# Altium project recall_ble_mod_v0_1.PrjPcb
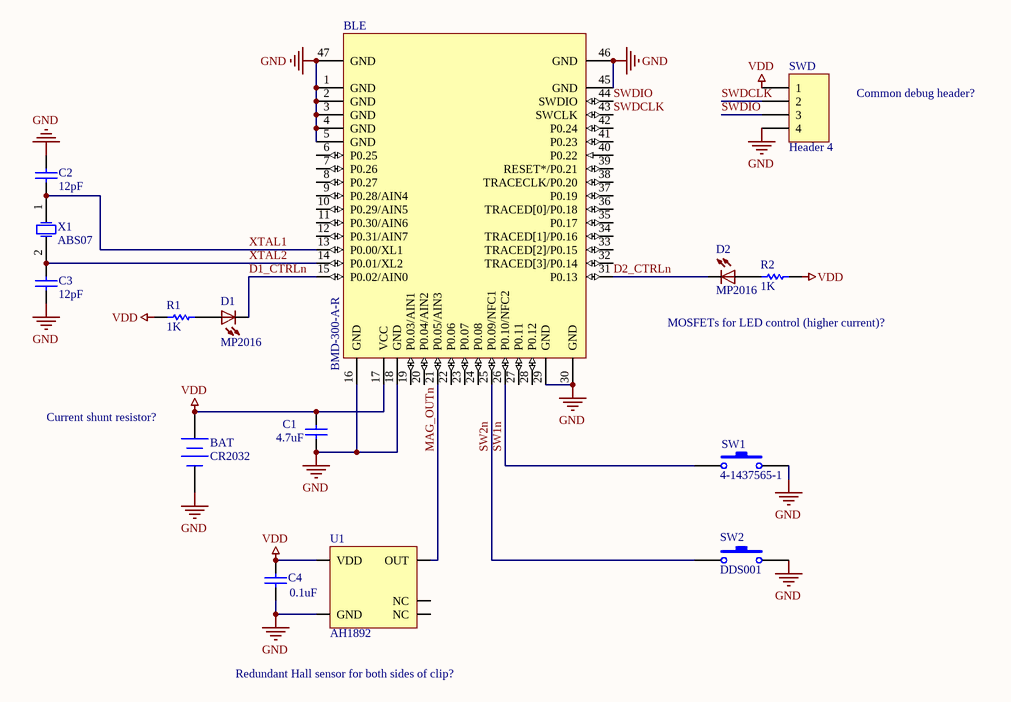
[diagram p0: recall_ble_mod_v0_1.SchDoc]
1 sheet, 15 parts. Net scope: global (net labels, ports and power ports of the same name join across sheets).
Board file: recall_ble_mod_v0_1.PcbDoc

## Sheet recall_ble_mod_v0_1.SchDoc
size A

### Parts
BAT  CR2032  [BAT-HLD-001-THM]
BLE  Manufacturer P/N: BMD-300-A-R  [BMD-300]  (hidden comment: BMD-300)
C1  value 4.7uF  [CAP_0603R]  (hidden comment: CAP)
C2  value 12pF  [CAP_0402R]  (hidden comment: CAP)
C3  value 12pF  [CAP_0402R]  (hidden comment: CAP)
C4  value 0.1uF  [CAP_0402R]  (hidden comment: CAP)
D1  MP2016  [MP2016_centered]
D2  MP2016  [MP2016_centered]
R1  value 1K  [RES_0402]  (hidden comment: RES)
R2  value 1K  [RES_0402]  (hidden comment: RES)
SW1  4-1437565-1  [4-1437565-1]
SW2  DDS001  [DDS001]
SWD  Header 4  [HDR1X4_SWD]
U1  AH1892  [sot-553]
X1  ABS07  [ABS07]

### Nets
GND: BAT.2(-) BLE.1(GND) BLE.2(GND) BLE.3(GND) BLE.4(GND) BLE.5(GND) BLE.16(GND) BLE.18(GND) BLE.29(GND) BLE.30(GND) BLE.45(GND) BLE.46(GND) BLE.47(GND) C1.1 C2.1 C3.1 C4.1 SW1.2 SW2.2 SWD.4 U1.4(GND)
VDD: BAT.1(+) BLE.17(VCC) C1.2 C4.2 R1.1 R2.1 SWD.1 U1.1(VDD)
D1_CTRLn: BLE.15(P0.02/AIN0) D1.C
D2_CTRLn: BLE.31(P0.13) D2.C
MAG_OUTn: BLE.21(P0.05/AIN3) U1.5(OUT)
SW1n: BLE.26(P0.10/NFC2) SW1.1
SW2n: BLE.25(P0.09/NFC1) SW2.1
SWDCLK: BLE.43(SWCLK) SWD.2
SWDIO: BLE.44(SWDIO) SWD.3
XTAL1: BLE.13(P0.00/XL1) C2.2 X1.1(OSC1)
XTAL2: BLE.14(P0.01/XL2) C3.2 X1.2(OSC2)
NetD1_A: D1.A R1.2
NetD2_A: D2.A R2.2

Not connected (* = marked no-connect by the designer): BLE 6(P0.25) 7(P0.26) 8(P0.27) 9(P0.28/AIN4) 10(P0.29/AIN5) 11(P0.30/AIN6) 12(P0.31/AIN7) 19(P0.03/AIN1) 20(P0.04/AIN2) 22(P0.06) 23(P0.07) 24(P0.08) 27(P0.11) 28(P0.12) 32(TRACED[3]/P0.14) 33(TRACED[2]/P0.15) 34(TRACED[1]/P0.16) 35(P0.17) 36(TRACED[0]/P0.18) 37(P0.19) 38(TRACECLK/P0.20) 39(RESET*/P0.21) 40(P0.22) 41(P0.23) 42(P0.24); U1 2(NC) 3(NC)

### Notes on the sheet
- Common debug header?
- MOSFETs for LED control (higher current)?
- (near BAT) Current shunt resistor?
- Redundant Hall sensor for both sides of clip?

### Library data of the parts
BAT = Battery: Published: 24-Mar-1999; LatestRevisionDate: 17-Jul-2002; LatestRevisionNote: Re-released for DXP Platform.; PackageReference: BAT-2; Publisher: Altium Limited; PackageDescription: Battery; 2 Leads
BLE = BMD-300-A: Bluetooth 4.2 LE Module, nRF52832, 512kB Flash, 64kB RAM; Manufacturer: Rigado; Internal Antenna: Yes; Protocol: BLE 4.2; RF Freq: 2.4GHz; Added By: Cam N; Part Number: BMD-300-A; Size: 14mm x 9.8mm; Height: 1.9mm; Added Date: 10/14/2015
C1-C4 = CAP: Capacitor; Published: 8-Jun-2000; LatestRevisionDate: 29-May-2009; LatestRevisionNote: IPC-7351 Footprint Added.; PackageReference: C1206; Publisher: Altium Limited; PackageDescription: Chip Capacitor
D1 D2 = MP2016: MP2016 White LED
R1 R2 = RES: Resistor; Published: 8-Jun-2000; LatestRevisionDate: 17-Jul-2002; LatestRevisionNote: Re-released for DXP Platform.; PackageReference: AXIAL-0.3; Publisher: Altium Limited; PackageDescription: Axial Device, Thru-Hole; 2 Leads; 0.3 in Pin Spacing
SW1 = SW-TACT: Translucent Conductive Silicone Elastomer Switch; Published: 24-Mar-1999; LatestRevisionDate: 17-Jul-2002; LatestRevisionNote: Re-released for DXP Platform.; PackageReference: SPST-2; Publisher: Altium Limited; PackageDescription: Switch; 2 Leads
SW2 = SW-PB: Translucent Conductive Silicone Elastomer Switch; Published: 24-Mar-1999; LatestRevisionDate: 17-Jul-2002; LatestRevisionNote: Re-released for DXP Platform.; PackageReference: SPST-2; Publisher: Altium Limited; PackageDescription: Switch; 2 Leads
SWD = Header 4: Header, 4-Pin; LatestRevisionDate: 17-Jul-2002; LatestRevisionNote: Re-released for DXP Platform.; Publisher: Altium Limited
U1 = AH1892: Hall effect switch
X1 = ABS07: ABS25